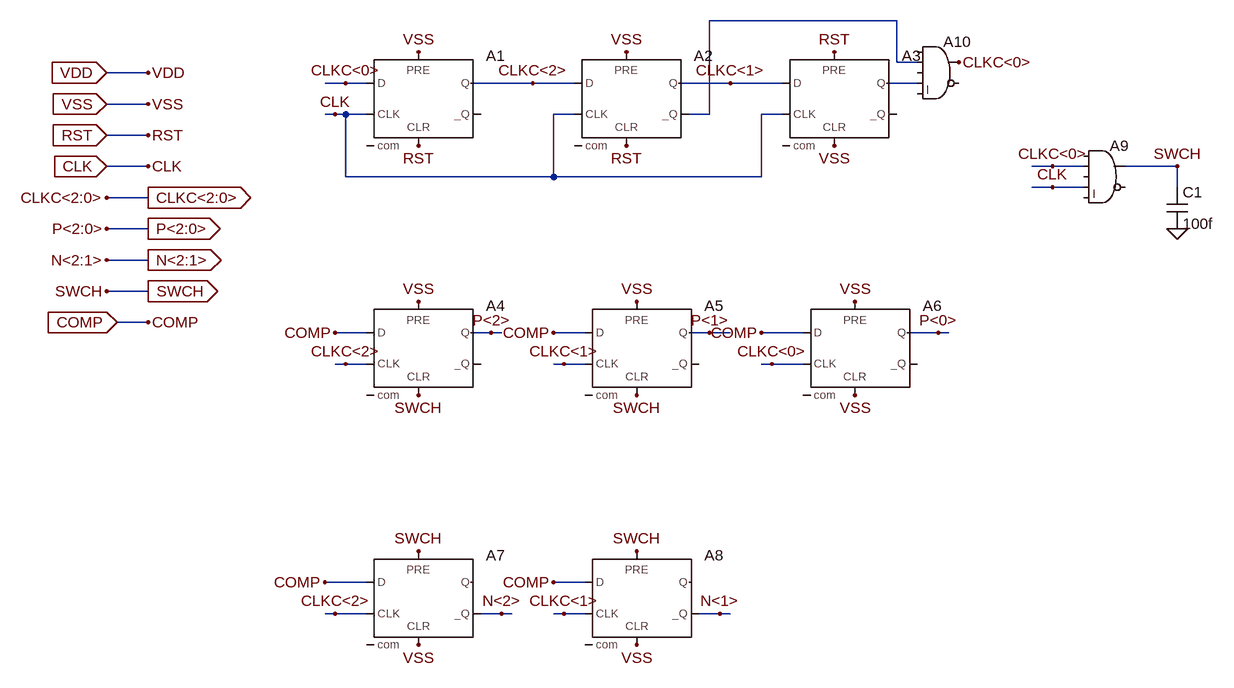
[diagram p0: schematic 3bit_SAR_logic.asc]
3bit_SAR_logic.asc, the LTspice schematic file:
Version 4
SHEET 1 1780 984
WIRE 880 -32 592 -32
WIRE 880 32 880 -32
WIRE 912 32 880 32
WIRE -272 48 -336 48
WIRE 32 64 0 64
WIRE 64 64 32 64
WIRE 320 64 224 64
WIRE 384 64 320 64
WIRE 624 64 544 64
WIRE 704 64 624 64
WIRE 912 64 864 64
WIRE -272 96 -336 96
WIRE 16 112 0 112
WIRE 32 112 16 112
WIRE 64 112 32 112
WIRE 384 112 352 112
WIRE 592 112 592 -32
WIRE 592 112 560 112
WIRE 704 112 672 112
WIRE -272 144 -336 144
WIRE -272 192 -336 192
WIRE 1120 192 1088 192
WIRE 1168 192 1120 192
WIRE 1312 192 1232 192
WIRE 32 208 32 112
WIRE 352 208 352 112
WIRE 352 208 32 208
WIRE 672 208 672 112
WIRE 672 208 352 208
WIRE 1120 224 1088 224
WIRE 1168 224 1120 224
WIRE 1312 224 1312 192
WIRE -272 240 -336 240
WIRE -272 288 -336 288
WIRE -272 336 -336 336
WIRE -272 384 -336 384
WIRE -272 432 -320 432
WIRE 64 448 16 448
WIRE 256 448 224 448
WIRE 272 448 256 448
WIRE 400 448 352 448
WIRE 592 448 560 448
WIRE 624 448 592 448
WIRE 736 448 672 448
WIRE 944 448 896 448
WIRE 960 448 944 448
WIRE 32 496 16 496
WIRE 64 496 32 496
WIRE 368 496 352 496
WIRE 400 496 368 496
WIRE 688 496 672 496
WIRE 736 496 688 496
WIRE 64 832 0 832
WIRE 400 832 352 832
WIRE 16 880 0 880
WIRE 64 880 16 880
WIRE 272 880 240 880
WIRE 288 880 272 880
WIRE 368 880 352 880
WIRE 400 880 368 880
WIRE 608 880 576 880
WIRE 624 880 608 880
FLAG 32 64 CLKC<0>
FLAG 320 64 CLKC<2>
FLAG 624 64 CLKC<1>
FLAG 16 112 CLK
FLAG 144 400 VSS
FLAG 816 400 VSS
FLAG 480 400 VSS
FLAG 816 544 VSS
FLAG 144 784 SWCH
FLAG 480 784 SWCH
FLAG 256 448 P<2>
FLAG 592 448 P<1>
FLAG 944 448 P<0>
FLAG 32 496 CLKC<2>
FLAG 368 496 CLKC<1>
FLAG 688 496 CLKC<0>
FLAG 16 880 CLKC<2>
FLAG 368 880 CLKC<1>
FLAG 272 880 N<2>
FLAG 608 880 N<1>
FLAG 1120 192 CLKC<0>
FLAG 1120 224 CLK
FLAG -336 48 VDD
IOPIN -336 48 In
FLAG -336 96 VSS
IOPIN -336 96 In
FLAG -336 144 RST
IOPIN -336 144 In
FLAG -336 192 CLK
IOPIN -336 192 In
FLAG -272 96 VSS
FLAG -272 192 CLK
FLAG -272 240 CLKC<2:0>
IOPIN -272 240 Out
FLAG -272 288 P<2:0>
IOPIN -272 288 Out
FLAG -272 336 N<2:1>
IOPIN -272 336 Out
FLAG -272 384 SWCH
IOPIN -272 384 Out
FLAG -336 240 CLKC<2:0>
FLAG -336 288 P<2:0>
FLAG -336 336 N<2:1>
FLAG -336 384 SWCH
FLAG 784 160 VSS
FLAG 144 160 RST
FLAG 464 160 RST
FLAG 144 16 VSS
FLAG 464 16 VSS
FLAG 784 16 RST
FLAG 352 448 COMP
FLAG 672 448 COMP
FLAG 352 832 COMP
FLAG 0 832 COMP
FLAG 16 448 COMP
FLAG -320 432 COMP
IOPIN -320 432 In
FLAG -272 432 COMP
FLAG -272 144 RST
FLAG -272 48 VDD
FLAG 976 32 CLKC<0>
FLAG 1312 288 0
FLAG 144 544 SWCH
FLAG 480 544 SWCH
FLAG 144 928 VSS
FLAG 480 928 VSS
FLAG 1312 192 SWCH
SYMBOL Digital\\dflop 144 16 R0
SYMATTR InstName A1
SYMATTR SpiceLine Trise 1n
SYMBOL Digital\\dflop 464 16 R0
SYMATTR InstName A2
SYMATTR SpiceLine Trise 1n
SYMBOL Digital\\dflop 784 16 R0
SYMATTR InstName A3
SYMATTR SpiceLine Trise 1n
SYMBOL Digital\\dflop 144 400 R0
SYMATTR InstName A4
SYMATTR SpiceLine Trise 10n Tfall 10n
SYMBOL Digital\\dflop 480 400 R0
SYMATTR InstName A5
SYMATTR SpiceLine Trise 10n Tfall 10n
SYMBOL Digital\\dflop 816 400 R0
SYMATTR InstName A6
SYMATTR SpiceLine Trise 10n Tfall 10n
SYMBOL Digital\\dflop 144 784 R0
SYMATTR InstName A7
SYMATTR SpiceLine Trise 10n Tfall 10n
SYMBOL Digital\\dflop 480 784 R0
SYMATTR InstName A8
SYMATTR SpiceLine Trise 10n Tfall 10n
SYMBOL Digital\\and 1200 144 R0
SYMATTR InstName A9
SYMATTR SpiceLine Trise 10n Tfall 10n
SYMBOL Digital\\and 944 -16 R0
SYMATTR InstName A10
SYMATTR SpiceLine Trise 1n
SYMBOL cap 1296 224 R0
SYMATTR InstName C1
SYMATTR Value 100f

The netlist it stands for:
* 3bit_SAR_logic.asc
A1 CLKC<0> 0 CLK VSS RST 0 CLKC<2> 0 DFLOP Trise 1n
A2 CLKC<2> 0 CLK VSS RST N001 CLKC<1> 0 DFLOP Trise 1n
A3 CLKC<1> 0 CLK RST VSS 0 N002 0 DFLOP Trise 1n
A4 COMP 0 CLKC<2> VSS SWCH 0 P<2> 0 DFLOP Trise 10n Tfall 10n
A5 COMP 0 CLKC<1> VSS SWCH 0 P<1> 0 DFLOP Trise 10n Tfall 10n
A6 COMP 0 CLKC<0> VSS VSS 0 P<0> 0 DFLOP Trise 10n Tfall 10n
A7 COMP 0 CLKC<2> SWCH VSS N<2> 0 0 DFLOP Trise 10n Tfall 10n
A8 COMP 0 CLKC<1> SWCH VSS N<1> 0 0 DFLOP Trise 10n Tfall 10n
A9 0 CLKC<0> 0 CLK 0 0 SWCH 0 AND Trise 10n Tfall 10n
A10 0 N001 0 N002 0 0 CLKC<0> 0 AND Trise 1n
C1 SWCH 0 100f
.backanno
.end